# Altium schematic sheet ImageSensor_IMX415.SchDoc
size A4; SheetNumber: 6; SheetTotal: 6
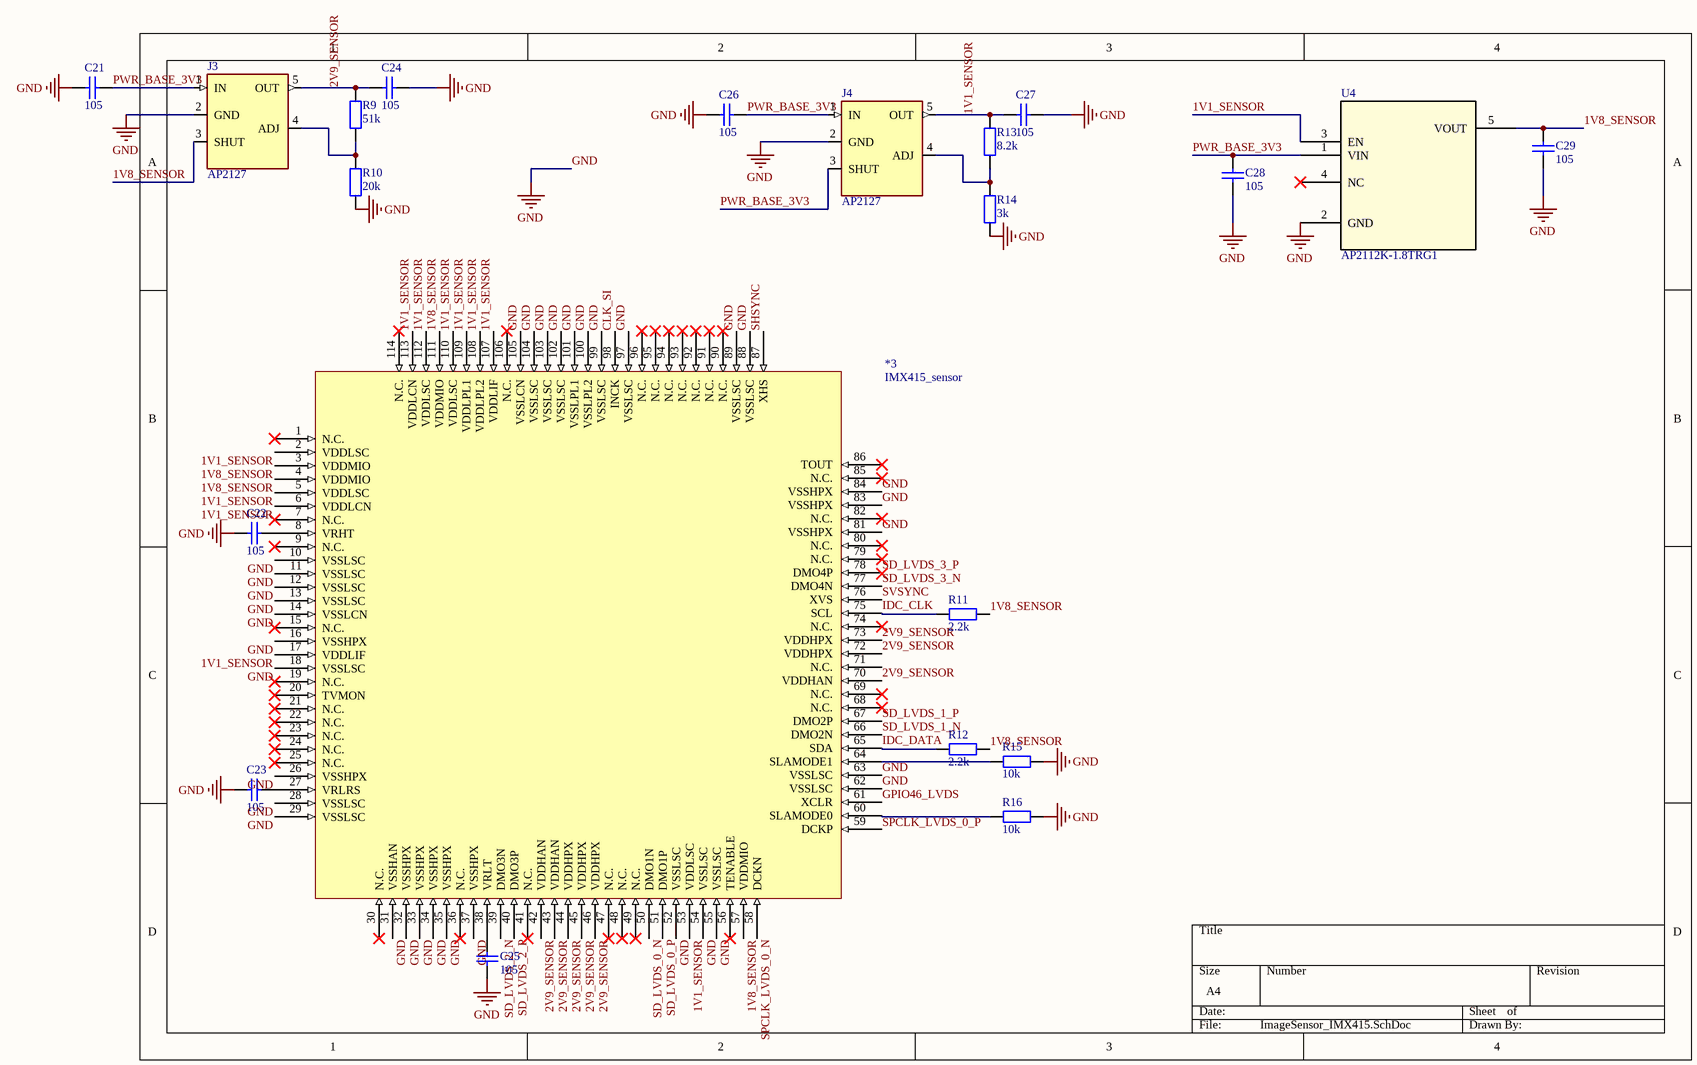
[diagram p0: ImageSensor_IMX415.SchDoc]

## Parts
*3  IMX415_sensor  [IMX415_sensor - duplicate]
C21  105  [tu 0603]
C22  105  [tu 0603]
C23  105  [tu 0603]
C24  105  [tu 0603]
C25  105  [tu 0603]
C26  105  [tu 0603]
C27  105  [tu 0603]
C28  105  [tu 0603]
C29  105  [tu 0603]
J3  AP2127  [AP2127K-3.3]
J4  AP2127  [AP2127K-3.3]
R9  51k  [tro smd 0603]
R10  20k  [tro smd 0805]
R11  2.2k  [tro smd 0805]
R12  2.2k  [tro smd 0805]
R13  8.2k  [tro smd 0805]
R14  3k  [tro smd 0805]
R15  10k  [tro smd 0603]
R16  10k  [tro smd 0603]
U4  AP2112K-1.8TRG1  [AP2112K-1.8TRG1_DIO]

## Nets
GND: *3.10(VSSLSC) *3.11(VSSLSC) *3.12(VSSLSC) *3.13(VSSLSC) *3.14(VSSLCN) *3.16(VSSHPX) *3.18(VSSLSC) *3.26(VSSHPX) *3.28(VSSLSC) *3.29(VSSLSC) *3.31(VSSHAN) *3.32(VSSHPX) *3.33(VSSHPX) *3.34(VSSHPX) *3.35(VSSHPX) *3.37(VSSHPX) *3.52(VSSLSC) *3.54(VSSLSC) *3.55(VSSLSC) *3.62(VSSLSC) *3.63(VSSLSC) *3.81(VSSHPX) *3.83(VSSHPX) *3.84(VSSHPX) *3.88(VSSLSC) *3.89(VSSLSC) *3.97(VSSLSC) *3.99(VSSLSC) *3.100(VSSLPL2) *3.101(VSSLPL1) *3.102(VSSLSC) *3.103(VSSLSC) *3.104(VSSLSC) *3.105(VSSLCN) C21.1 C22.2 C23.2 C24.1 C25.2 C26.1 C27.1 C28.1 C29.1 J3.2(GND) J4.2(GND) R10.1 R14.1 R15.1 R16.1 U4.2(GND)
1V1_SENSOR: *3.2(VDDLSC) *3.5(VDDLSC) *3.6(VDDLCN) *3.17(VDDLIF) *3.53(VDDLSC) *3.107(VDDLIF) *3.108(VDDLPL2) *3.109(VDDLPL1) *3.110(VDDLSC) *3.112(VDDLSC) *3.113(VDDLCN) C27.2 J4.5(OUT) R13.2 U4.3(EN)
1V8_SENSOR: *3.3(VDDMIO) *3.4(VDDMIO) *3.57(VDDMIO) *3.111(VDDMIO) C29.2 J3.3(SHUT) R11.2 R12.2 U4.5(VOUT)
2V9_SENSOR: *3.42(VDDHAN) *3.43(VDDHAN) *3.44(VDDHPX) *3.45(VDDHPX) *3.46(VDDHPX) *3.70(VDDHAN) *3.72(VDDHPX) *3.73(VDDHPX) C24.2 J3.5(OUT) R9.2
CLK_SI: *3.98(INCK)
GPIO46_LVDS: *3.61(XCLR)
IDC_CLK: *3.75(SCL) R11.1
IDC_DATA: *3.65(SDA) R12.1
PWR_BASE_3V3: C21.2 C26.2 C28.2 J3.1(IN) J4.1(IN) J4.3(SHUT) U4.1(VIN)
SD_LVDS_0_N: *3.50(DMO1N)
SD_LVDS_0_P: *3.51(DMO1P)
SD_LVDS_1_N: *3.66(DMO2N)
SD_LVDS_1_P: *3.67(DMO2P)
SD_LVDS_2_N: *3.39(DMO3N)
SD_LVDS_2_P: *3.40(DMO3P)
SD_LVDS_3_N: *3.77(DMO4N)
SD_LVDS_3_P: *3.78(DMO4P)
SHSYNC: *3.87(XHS)
SPCLK_LVDS_0_N: *3.58(DCKN)
SVSYNC: *3.76(XVS)
Net*3_8: *3.8(VRHT) C22.1
Net*3_27: *3.27(VRLRS) C23.1
Net*3_38: *3.38(VRLT) C25.1
Net*3_60: *3.60(SLAMODE0) R16.2
Net*3_64: *3.64(SLAMODE1) R15.2
NetJ3_4: J3.4(ADJ) R9.1 R10.2
NetJ4_4: J4.4(ADJ) R13.1 R14.2

Not connected (* = marked no-connect by the designer): *3 1(N.C.)* 7(N.C.)* 9(N.C.)* 15(N.C.)* 19(N.C.)* 20(TVMON)* 21(N.C.)* 22(N.C.)* 23(N.C.)* 24(N.C.)* 25(N.C.)* 30(N.C.)* 36(N.C.)* 41(N.C.)* 47(N.C.)* 48(N.C.)* 49(N.C.)* 56(TENABLE)* 59(DCKP) 68(N.C.)* 69(N.C.)* 71(N.C.) 74(N.C.)* 79(N.C.)* 80(N.C.)* 82(N.C.)* 85(N.C.)* 86(TOUT)* 90(N.C.)* 91(N.C.)* 92(N.C.)* 93(N.C.)* 94(N.C.)* 95(N.C.)* 96(N.C.)* 106(N.C.)* 114(N.C.)*; U4 4(NC)*

## Notes on the sheet
- Labels drawn without touching a wire or pin: SPCLK_LVDS_0_P

## Library data of the parts
C21-C29 = Tu 0603 105 16V 20%: Dán; Don_Vi: Con; So_Chan: 2; Ten_Linh_Kien: Tụ 0603 105-1uF 20% 16V; Ma_Hang: MH004574; Chung_Loai: Dán; Kieu_Chan: *
J3 J4 = AP2127: LDO Regulator Pos 1.8V 0.4A 5-Pin SOT-23 T/R / IC REG LDO 1.8V 0.3A SOT23-5; MF: Diodes Incorporated; SnapEDA_Link: https://www.snapeda.com/parts/AP2127/EDTM+Incorporated/view-part/?ref=snap; Package: None; Value: *; MP: AP2127; Check_prices: https://www.snapeda.com/parts/AP2127/EDTM+Incorporated/view-part/?ref=eda
R9 = Tro 0603 5% 51k: Dán; Don_Vi: Con; So_Chan: 2; Ten_Linh_Kien: Trở 0603 5% 51k; Ma_Hang: MH007666; Chung_Loai: Dán; Kieu_Chan: *
R10 = Tro 0805 5% 20k: Dán; Don_Vi: Con; So_Chan: 2; Ten_Linh_Kien: Trở 0805 5% 20k; Ma_Hang: MH005247; Chung_Loai: Dán; Kieu_Chan: *
R11 R12 = Tro 0805 5% 2.2k: Dán; Don_Vi: Con; So_Chan: 2; Ten_Linh_Kien: Trở 0805 5% 2.2k; Ma_Hang: MH005237; Chung_Loai: Dán; Kieu_Chan: *
R13 = Tro 0805 5% 8.2k: Dán; Don_Vi: Con; So_Chan: 2; Ten_Linh_Kien: Trở 0805 5% 8.2k; Ma_Hang: MH005312; Chung_Loai: Dán; Kieu_Chan: *
R14 = Tro 0805 5% 3k: Dán; Don_Vi: Con; So_Chan: 2; Ten_Linh_Kien: Trở 0805 5% 3k; Ma_Hang: MH005306; Chung_Loai: Dán; Kieu_Chan: *
R15 R16 = Tro 0603 1% 10k: Dán; Don_Vi: Con; So_Chan: 2; Ten_Linh_Kien: Trở 0603 1% 10k; Ma_Hang: MH006333; Chung_Loai: Dán; Kieu_Chan: *
U4 = AP2112K-1.8TRG1: Description; Manufacturer_Name: Diodes Inc; Copyright: Copyright (C) 2026 Ultra Librarian. All rights reserved.; Manufacturer_Part_Number: AP2112K-1.8TRG1; RefDes: RefDes; Type: Type